# Altium schematic sheet CP2200.SchDoc
size A
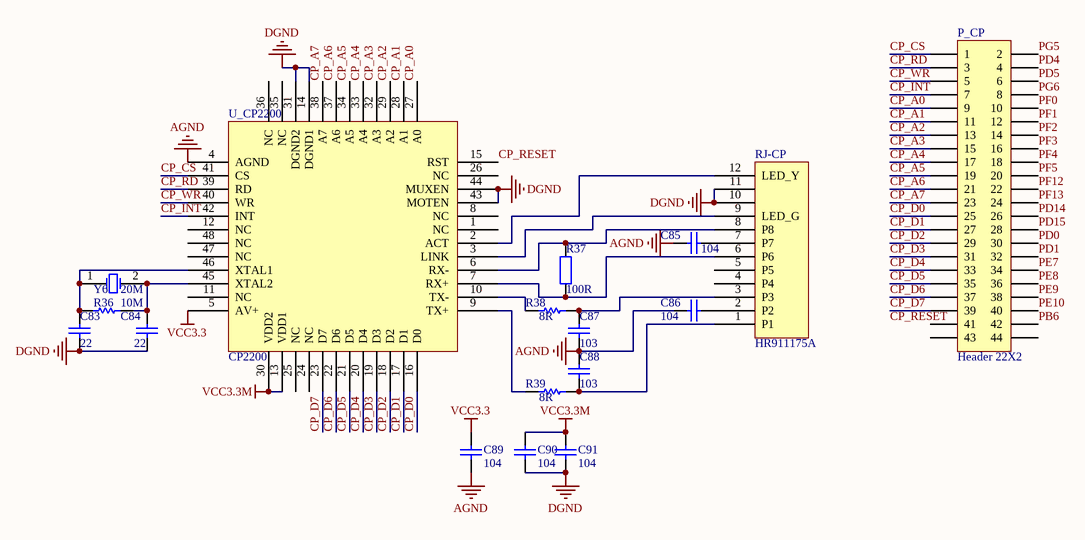
[diagram p0: CP2200.SchDoc]

## Parts
C83  value 22  [SMT-0603]  (hidden comment: Cap)
C84  value 22  [SMT-0603]  (hidden comment: Cap)
C85  value 104  [SMT-0603]  (hidden comment: Cap)
C86  value 104  [SMT-0603]  (hidden comment: Cap)
C87  value 103  [SMT-0603]  (hidden comment: Cap)
C88  value 103  [SMT-0603]  (hidden comment: Cap)
C89  value 104  [SMT-0603]  (hidden comment: Cap)
C90  value 104  [SMT-0603]  (hidden comment: Cap)
C91  value 104  [SMT-0603]  (hidden comment: Cap)
P_CP  Header 22X2  [HDR2X22]
R36  value 10M  [SMT-0603]  (hidden comment: Res1)
R37  value 100R  [SMT-0603]  (hidden comment: Res2)
R38  value 8R  [SMT-0603]  (hidden comment: Res1)
R39  value 8R  [SMT-0603]  (hidden comment: Res1)
RJ-CP  HR911175A  [RJ45-LED]
U_CP2200  CP2200  [LQFP48L]
Y6  20M  [D-CRYSTAL_UPRIGHT]

## Nets
AGND: C85.1 C86.1 C87.2 C88.1 C89.1 U_CP2200.4(AGND)
DGND: C83.1 C84.1 C90.1 C91.1 RJ-CP.10 RJ-CP.11 U_CP2200.14(DGND1) U_CP2200.31(DGND2) U_CP2200.43(MOTEN) U_CP2200.44(MUXEN)
VCC3.3: C89.2 U_CP2200.5(AV+)
VCC3.3M: C90.2 C91.2 U_CP2200.13(VDD1) U_CP2200.30(VDD2)
CP_A0: P_CP.9 U_CP2200.27(A0)
CP_A1: P_CP.11 U_CP2200.28(A1)
CP_A2: P_CP.13 U_CP2200.29(A2)
CP_A3: P_CP.15 U_CP2200.32(A3)
CP_A4: P_CP.17 U_CP2200.33(A4)
CP_A5: P_CP.19 U_CP2200.34(A5)
CP_A6: P_CP.21 U_CP2200.37(A6)
CP_A7: P_CP.23 U_CP2200.38(A7)
CP_CS: P_CP.1 U_CP2200.41(CS)
CP_D0: P_CP.25 U_CP2200.16(D0)
CP_D1: P_CP.27 U_CP2200.17(D1)
CP_D2: P_CP.29 U_CP2200.18(D2)
CP_D3: P_CP.31 U_CP2200.19(D3)
CP_D4: P_CP.33 U_CP2200.20(D4)
CP_D5: P_CP.35 U_CP2200.21(D5)
CP_D6: P_CP.37 U_CP2200.22(D6)
CP_D7: P_CP.39 U_CP2200.23(D7)
CP_INT: P_CP.7 U_CP2200.42(INT)
CP_RD: P_CP.3 U_CP2200.39(RD)
CP_RESET: U_CP2200.15(RST)
CP_WR: P_CP.5 U_CP2200.40(WR)
PB6: P_CP.42
PD0: P_CP.30
PD1: P_CP.32
PD4: P_CP.4
PD5: P_CP.6
PD14: P_CP.26
PD15: P_CP.28
PE7: P_CP.34
PE8: P_CP.36
PE9: P_CP.38
PE10: P_CP.40
PF0: P_CP.10
PF1: P_CP.12
PF2: P_CP.14
PF3: P_CP.16
PF4: P_CP.18
PF5: P_CP.20
PF12: P_CP.22
PF13: P_CP.24
PG5: P_CP.2
PG6: P_CP.8
NetC83_2: C83.2 R36.1 U_CP2200.46(XTAL1) Y6.1(OSC1)
NetC84_2: C84.2 R36.2 U_CP2200.45(XTAL2) Y6.2(OSC2)
NetC85_2: C85.2 RJ-CP.7(P7)
NetC86_2: C86.2 RJ-CP.2(P2)
NetC87_1: C87.1 R38.2 RJ-CP.3(P3)
NetC88_2: C88.2 R39.2 RJ-CP.1(P1)
NetR37_1: R37.1 RJ-CP.6(P6) U_CP2200.7(RX+)
NetR37_2: R37.2 RJ-CP.8(P8) U_CP2200.6(RX-)
NetR38_1: R38.1 U_CP2200.10(TX-)
NetR39_1: R39.1 U_CP2200.9(TX+)
NetRJ-CP_9: RJ-CP.9(LED_G) U_CP2200.3(LINK)
NetRJ-CP_12: RJ-CP.12(LED_Y) U_CP2200.2(ACT)

Not connected (* = marked no-connect by the designer): P_CP 41 43 44; RJ-CP 4(P4) 5(P5); U_CP2200 1(NC) 8(NC) 11(NC) 12(NC) 24(NC) 25(NC) 26(NC) 35(NC) 36(NC) 47(NC) 48(NC)

## Notes on the sheet
- Labels drawn without touching a wire or pin: CP_RESET

## Library data of the parts
C83-C91 = Cap: Capacitor; Published: 8-Jun-2000; LatestRevisionDate: 17-Jul-2002; LatestRevisionNote: Re-released for DXP Platform.; PackageReference: RAD-0.3; Publisher: Altium Limited; PackageDescription: Radial Cap, Thru-Hole; 2 Leads; 0.3 in Pin Spacing
P_CP = Header 22X2: Header, 22-Pin, Dual row; LatestRevisionDate: 17-Jul-2002; LatestRevisionNote: Re-released for DXP Platform.; Publisher: Altium Limited
R36 R38 R39 = Res1: Resistor; Published: 8-Jun-2000; LatestRevisionDate: 17-Jul-2002; LatestRevisionNote: Re-released for DXP Platform.; PackageReference: AXIAL-0.3; Publisher: Altium Limited; PackageDescription: Axial Device, Thru-Hole; 2 Leads; 0.3 in Pin Spacing
R37 = Res2: Resistor; Published: 8-Jun-2000; LatestRevisionDate: 17-Jul-2002; LatestRevisionNote: Re-released for DXP Platform.; PackageReference: AXIAL-0.4; Publisher: Altium Limited; PackageDescription: Axial Device, Thru-Hole; 2 Leads; 0.4 in Pin Spacing
RJ-CP = RJ-45 HR911175A
Y6 = XTAL: Crystal Oscillator; Published: 8-Jun-2000; LatestRevisionDate: 17-Jul-2002; LatestRevisionNote: Re-released for DXP Platform.; PackageReference: R38; Publisher: Altium Limited; PackageDescription: Crystal, Thru-Hole; 2 Leads; Body 3.1 x 8.2 mm (Dia.xH)